# EAGLE design Qwiic_Spectral_Sensor-AS7265x-BottomJig (EAGLE 9.2.1)
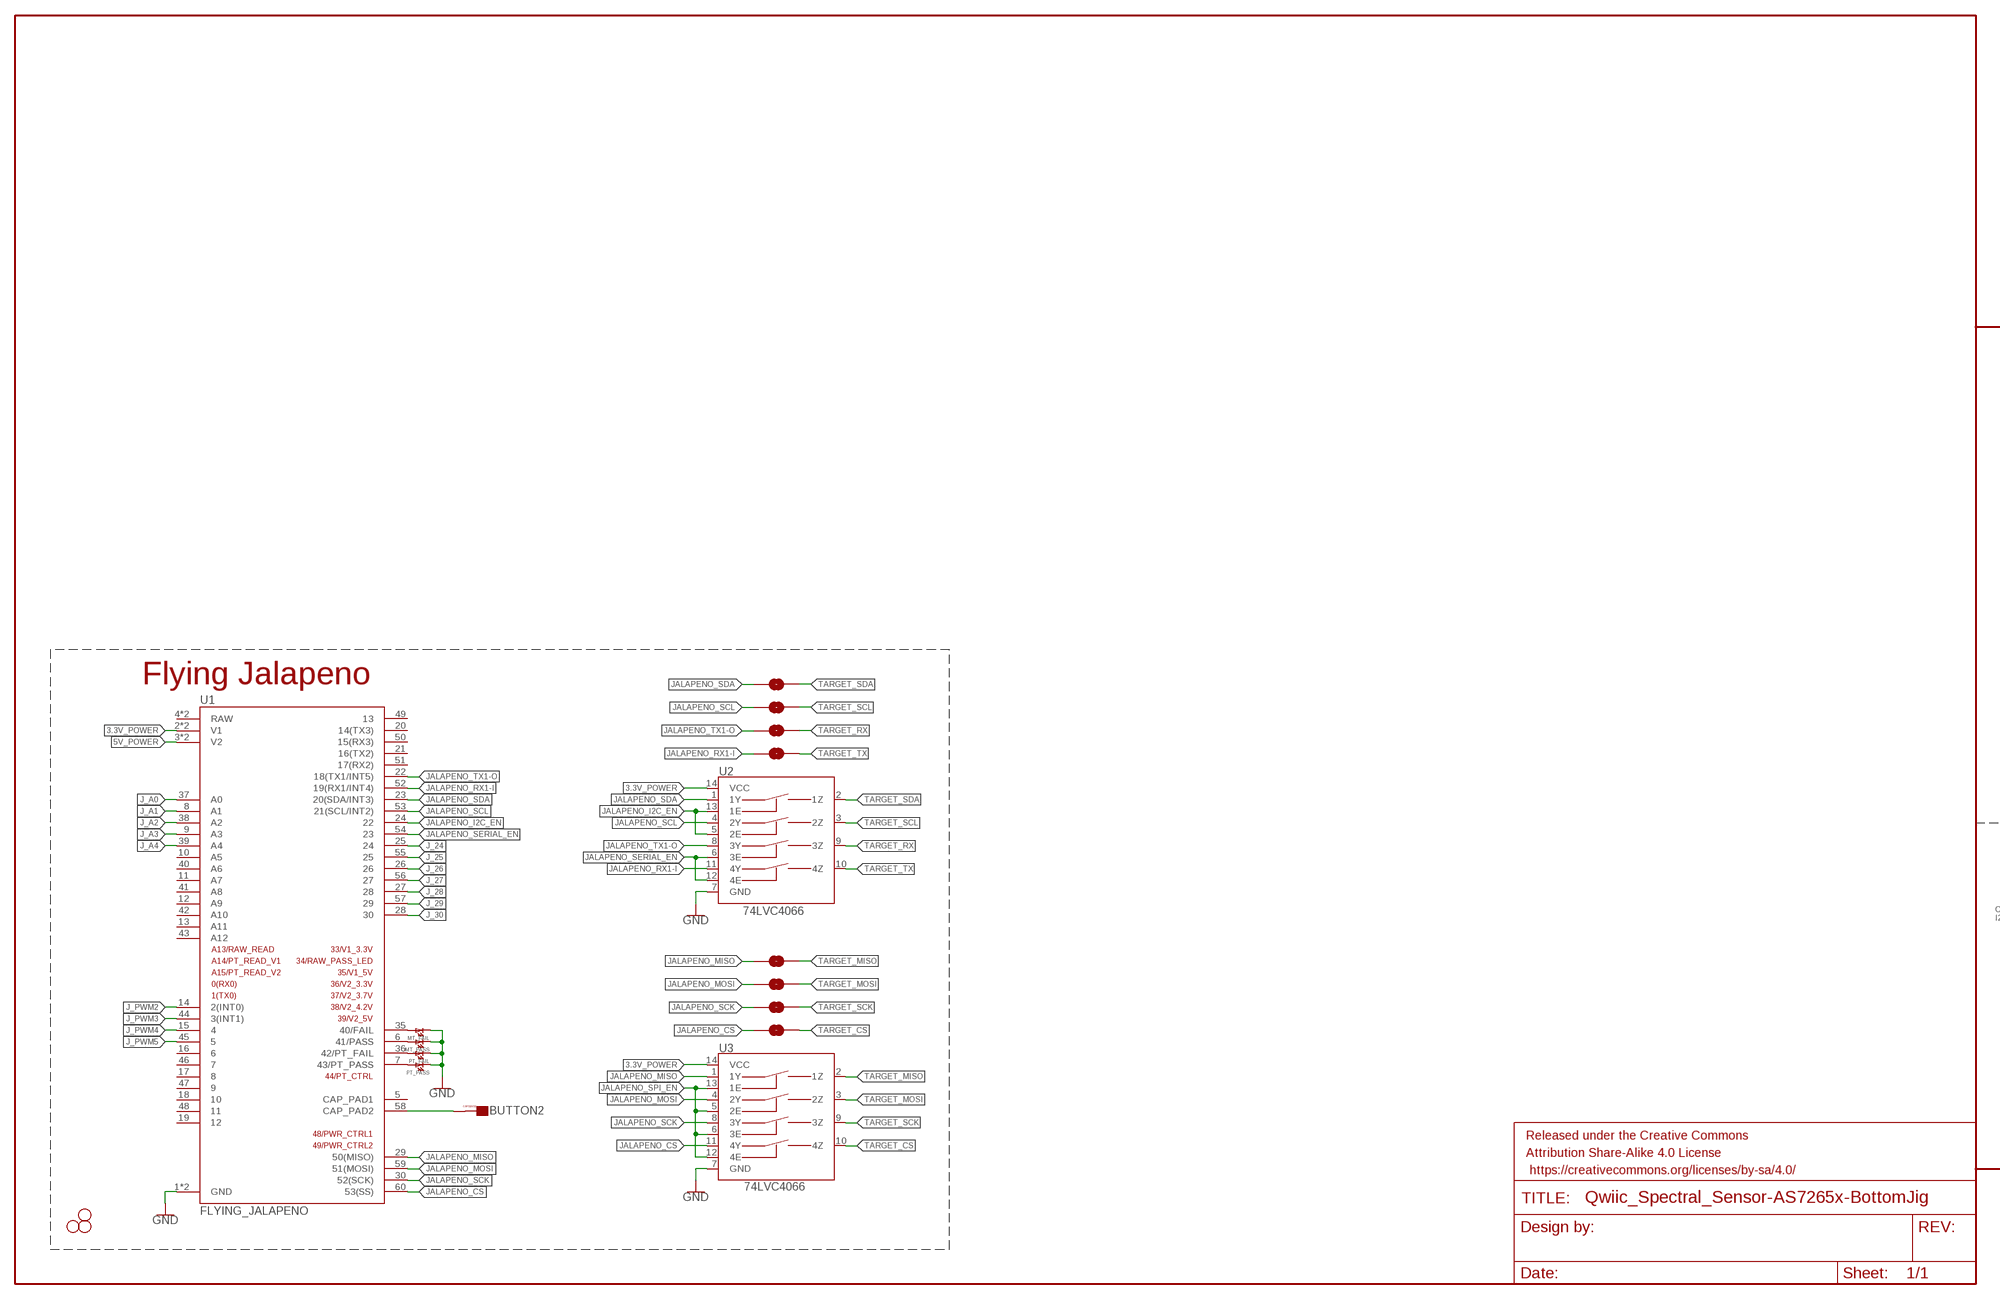
[diagram p0: schematic, sheet 1, part 1 of 2]
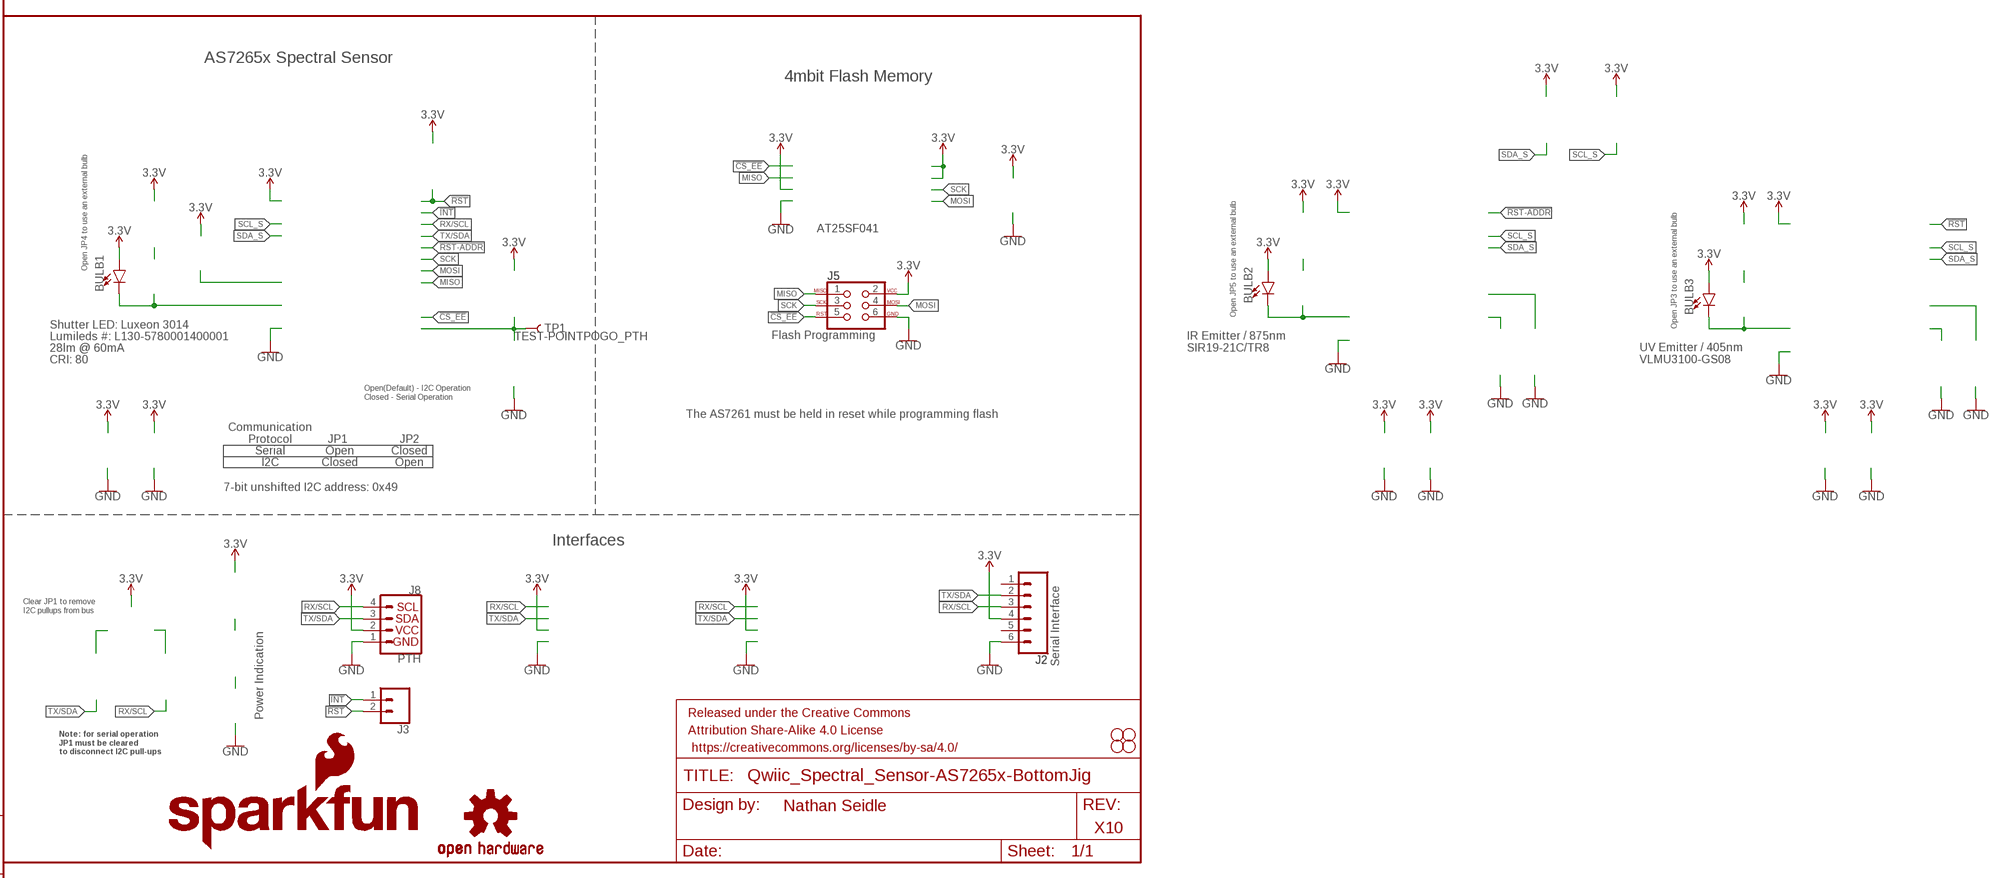
[diagram p1: schematic, sheet 1, part 2 of 2]

## Parts
BULB1  LEDNS  [LED_5MM_NOSILK]
BULB2  LEDNS  [LED_5MM_NOSILK]
BULB3  LEDNS  [LED_5MM_NOSILK]
BUTTON2  CAPSENSE_BUTTON_PAD_ONLY  [CAPSENSE_BUTTON_PADS_ONLY]
FRAME1  FRAME-LETTER  [CREATIVE_COMMONS]
FRAME2  FRAME-LEDGER  [CREATIVE_COMMONS]
H1  STAND-OFF  [STAND-OFF]
H2  STAND-OFF  [STAND-OFF]
H3  STAND-OFF  [STAND-OFF]
H4  STAND-OFF  [STAND-OFF]
H5  STAND-OFF  [STAND-OFF]
H6  STAND-OFF  [STAND-OFF]
H7  STAND-OFF  [STAND-OFF]
J2  Serial Interface  CONN_06NO_SILK_FEMALE_PTH  [1X06_NO_SILK]
J3  CONN_021X02_NO_SILK  [1X02_NO_SILK]
J5  Flash Programming  AVR_SPI_PROG_3X2NS  [2X3-NS]
J8  PTH  I2C_STANDARD_NO_SILK  [1X04_NO_SILK]
J_SCL  JUMPER-SMT_2_NO_NO-SILK  [SMT-JUMPER_2_NO_NO-SILK]
J_SCL1  JUMPER-SMT_2_NO_NO-SILK  [SMT-JUMPER_2_NO_NO-SILK]
J_SCL2  JUMPER-SMT_2_NO_NO-SILK  [SMT-JUMPER_2_NO_NO-SILK]
J_SCL3  JUMPER-SMT_2_NO_NO-SILK  [SMT-JUMPER_2_NO_NO-SILK]
J_SCL4  JUMPER-SMT_2_NO_NO-SILK  [SMT-JUMPER_2_NO_NO-SILK]
J_SCL5  JUMPER-SMT_2_NO_NO-SILK  [SMT-JUMPER_2_NO_NO-SILK]
J_SDA  JUMPER-SMT_2_NO_NO-SILK  [SMT-JUMPER_2_NO_NO-SILK]
J_SDA1  JUMPER-SMT_2_NO_NO-SILK  [SMT-JUMPER_2_NO_NO-SILK]
LOGO1  SFE_LOGO_NAME_FLAME.1_INCH  [SFE_LOGO_NAME_FLAME_.1]
LOGO4  OSHW-LOGOS  [OSHW-LOGO-S]
MT_FAIL  LED1206  [LED-1206]
MT_PASS  LED1206  [LED-1206]
PT_FAIL  LED1206  [LED-1206]
PT_PASS  LED1206  [LED-1206]
TP1  TEST-POINTPOGO_PTH  [1X01_NO_SILK]
U1  FLYING_JALAPENO  FLYING_JALAPENO_V3MALE  [FLYING_JALAPENO_V3_M]
U2  74LVC4066  74LVC4066_MUX_1:1_X4  [SO14]
U3  74LVC4066  74LVC4066_MUX_1:1_X4  [SO14]

## Nets
3.3V [VCC]: BULB1.A BULB2.A BULB3.A J2.4 J5.2 J8.2
3.3V_POWER [VCC]: U1.2(V1) U1.32(V1) U2.14(VCC) U3.14(VCC)
5V_POWER [POWA]: U1.3(V2) U1.33(V2)
!CS_EE: J5.5
!INT: J3.1
!RST: J3.2
BUTTON2 [CAPSENSE]: BUTTON2.CAPSENSE_PAD(CAPSENSE) U1.58(CAP_PAD2)
GND: J2.6 J5.6 J8.1 MT_FAIL.C MT_PASS.C PT_FAIL.C PT_PASS.C U1.1(GND) U1.31(GND) U2.7(GND) U3.7(GND)
I2C_ENB: TP1.1
J_24: U1.25
J_25: U1.55
J_26: U1.26
J_27: U1.56
J_28: U1.27
J_29: U1.57
J_30: U1.28
J_A0: U1.37(A0)
J_A1: U1.8(A1)
J_A2: U1.38(A2)
J_A3: U1.9(A3)
J_A4: U1.39(A4)
J_PWM2: U1.14(2(INT0))
J_PWM3: U1.44(3(INT1))
J_PWM4: U1.15
J_PWM5: U1.45
JALAPENO_CS: J_SDA1.1 U1.60(53(SS)) U3.11(4Y)
JALAPENO_I2C_EN: U1.24 U2.5(2E) U2.13(1E)
JALAPENO_MISO: J_SCL5.1 U1.29(50(MISO)) U3.1(1Y)
JALAPENO_MOSI: J_SCL3.1 U1.59(51(MOSI)) U3.4(2Y)
JALAPENO_RX1-I: J_SDA.1 U1.52(19(RX1/INT4)) U2.11(4Y)
JALAPENO_SCK: J_SCL4.1 U1.30(52(SCK)) U3.8(3Y)
JALAPENO_SCL: J_SCL.1 U1.53(21(SCL/INT2)) U2.4(2Y)
JALAPENO_SDA: J_SCL2.1 U1.23(20(SDA/INT3)) U2.1(1Y)
JALAPENO_SERIAL_EN: U1.54 U2.6(3E) U2.12(4E)
JALAPENO_SPI_EN: U3.5(2E) U3.6(3E) U3.12(4E) U3.13(1E)
JALAPENO_TX1-O: J_SCL1.1 U1.22(18(TX1/INT5)) U2.8(3Y)
LED_DRV: BULB1.K(C)
LED_DRV1: BULB2.K(C)
LED_DRV2: BULB3.K(C)
MISO: J5.1
MOSI: J5.4
N$10: PT_PASS.A U1.7(43/PT_PASS)
N$14: PT_FAIL.A U1.36(42/PT_FAIL)
N$15: MT_PASS.A U1.6(41/PASS)
N$16: MT_FAIL.A U1.35(40/FAIL)
RX/SCL: J2.3 J8.4
SCK: J5.3
TARGET_CS: J_SDA1.2 U3.10(4Z)
TARGET_MISO: J_SCL5.2 U3.2(1Z)
TARGET_MOSI: J_SCL3.2 U3.3(2Z)
TARGET_RX: J_SCL1.2 U2.9(3Z)
TARGET_SCK: J_SCL4.2 U3.9(3Z)
TARGET_SCL: J_SCL.2 U2.3(2Z)
TARGET_SDA: J_SCL2.2 U2.2(1Z)
TARGET_TX: J_SDA.2 U2.10(4Z)
TX/SDA: J2.2 J8.3
Unconnected: J2.1 J2.5 U1.4(RAW) U1.5(CAP_PAD1) U1.10(A5) U1.11(A7) U1.12(A9) U1.13(A11) U1.16 U1.17 U1.18 U1.19 U1.20(14(TX3)) U1.21(16(TX2)) U1.34(RAW) U1.40(A6) U1.41(A8) U1.42(A10) U1.43(A12) U1.46 U1.47 U1.48 U1.49 U1.50(15(RX3)) U1.51(17(RX2))

## Notes on the sheet
- AS7265x Spectral Sensor
- 4mbit Flash Memory
- AT25SF041
- Open JP4 to use an external bulb
- Open JP5 to use an external bulb
- Shutter LED: Luxeon 3014 | Open JP3 to use an external bulb
- Lumileds #: L130-5780001400001
- 28lm @ 60mA
- IR Emitter / 875nm
  SIR19-21C/TR8
- CRI: 80
- UV Emitter / 405nm
  VLMU3100-GS08
- Flying Jalapeno
- Open(Default) - I2C Operation
  Closed - Serial Operation
- The AS7261 must be held in reset while programming flash
- Communication
  Protocol
- JP1 | JP2
- Serial | Open | Closed
- I2C | Closed | Open
- 7-bit unshifted I2C address: 0x49
- Interfaces
- Clear JP1 to remove
  I2C pullups from bus
- Power Indication
- Note: for serial operation
  JP1 must be cleared
  to disconnect I2C pull-ups
- Nathan Seidle
- X10

## Library data of the parts
BULB1-BULB3 = SparkX:LED
BUTTON2 = Testing:CAPSENSE_BUTTON_PAD_ONLY
FRAME1 = SparkFun-Aesthetics:FRAME-LETTER: Schematic Frame - Letter Standard 8.5x11 US Letter frame
FRAME2 = SparkFun-Aesthetics:FRAME-LEDGER: Schematic Frame - Ledger Standard 11x14 US Ledger frame
H1-H7 = SparkFun-Hardware:STAND-OFF: Stand Off Drill holes for mechanically mounting via screws, standoffs, etc. Note: Use the keepout ring to avoid running the screw head into surrounding components. Variant Overviews STAND-OFF - Mechanical footprint for a #4 phillips button head screw. STAND-OFF-TIGHT - Mechanical footprint for a #4 phillips button head screw, Example SparkFun Products Screw - Phillips Head (1/4", 4-40, 10 pack) <https://www.sparkfun.com/products/10453> (PRT-10453) Screw - Phillips Head (1/2", 4-40, 10 pack) <https://www.sparkfun.com/products/10452> (PRT-10452) Screw - Phillips Head (3/4", 4-40, 10 pack) <https://www.sparkfun.com/products/10451> (PRT-10451) Screw - Phillips Head (1", 4-40, 10 pack) <https://www.sparkfun.com/products/10450> (PRT-10450)
J2 = SparkFun-Connectors:CONN_06: Multi connection point. Often used as Generic Header-pin footprint for 0.1 inch spaced/style header connections On any of the 0.1 inch spaced packages, you can populate with these: Break Away Headers - Straight <https://www.sparkfun.com/products/116> (PRT-00116) Break Away Male Headers - Right Angle <https://www.sparkfun.com/products/553> (PRT-00553) Female Headers <https://www.sparkfun.com/products/115> (PRT-00115) Break Away Headers - Machine Pin <https://www.sparkfun.com/products/117> (PRT-00117) Break Away Female Headers - Swiss Machine Pin <https://www.sparkfun.com/products/743> (PRT-00743) Arduino Stackable Header - 6 Pin <https://www.sparkfun.com/products/9280> (PRT-09280) For SCREWTERMINALS and SPRING TERMINALS visit here: Screw Terimnals on SparkFun.com <https://www.sparkfun.com/search/results?term=Screw+Terminals> (5mm/3.5mm/2.54mm spacing) This device is also useful as a general connection point to wire up your design to another part of your project. Our various solder wires solder well into these plated through hole pads. Hook-Up Wire - Assortment (Stranded, 22 AWG) <https://www.sparkfun.com/products/11375> (PRT-11375) Hook-Up Wire - Assortment (Solid Core, 22 AWG) <https://www.sparkfun.com/products/11367> (PRT-11367) View the entire wire category on our website here <https://www.sparkfun.com/categories/141>; PROD_ID: CONN-08437
J3 = SparkFun-Connectors:CONN_02: Multi connection point. Often used as Generic Header-pin footprint for 0.1 inch spaced/style header connections On any of the 0.1 inch spaced packages, you can populate with these: Break Away Headers - Straight <https://www.sparkfun.com/products/116> (PRT-00116) Break Away Male Headers - Right Angle <https://www.sparkfun.com/products/553> (PRT-00553) Female Headers <https://www.sparkfun.com/products/115> (PRT-00115) Break Away Headers - Machine Pin <https://www.sparkfun.com/products/117> (PRT-00117) Break Away Female Headers - Swiss Machine Pin <https://www.sparkfun.com/products/743> (PRT-00743) For SCREWTERMINALS and SPRING TERMINALS visit here: Screw Terimnals on SparkFun.com <https://www.sparkfun.com/search/results?term=Screw+Terminals> (5mm/3.5mm/2.54mm spacing) This device is also useful as a general connection point to wire up your design to another part of your project. Our various solder wires solder well into these plated through hole pads. Hook-Up Wire - Assortment (Stranded, 22 AWG) <https://www.sparkfun.com/products/11375> (PRT-11375) Hook-Up Wire - Assortment (Solid Core, 22 AWG) <https://www.sparkfun.com/products/11367> (PRT-11367) View the entire wire category on our website here <https://www.sparkfun.com/categories/141> Special notes: Molex polarized connector foot print use with: PRT-08233 with associated crimp pins and housings. 2.54_SCREWTERM for use with PRT-10571. 3.5mm Screw Terminal footprints for PRT-08084 5mm Screw Terminal footprints for use with PRT-08432
J5 = SparkFun-Connectors:AVR_SPI_PROG_3X2: AVR ISP 6 Pin This is the reduced ISP connector for AVR programming. Common on Arduino. This footprint will take up less PCB space and can be used with a 10-pin to 6-pin adapter such as SKU: BOB-08508 **Special note about "TEST_POINT" package. The stop mask is on the top side, so if you want your programming test points to be on the bottom of your board, make sure to place this package on the bottom side of the board. This also ensure that the orientation to program from the bottom side will be correct. SparkFun Products: SparkFun ISP Pogo Adapter <https://www.sparkfun.com/products/11591> - NS Tiny AVR Programmer <https://www.sparkfun.com/products/11801> -PTH
J8 = SparkFun-Connectors:I2C_STANDARD: SparkFun I2C Standard Pinout Header SparkFun has standardized on a pinout for all I2C based sensor breakouts. This pinout allows I2C boards to be plugged directly into the headers on Arduino Uno compatible boards, and to be daisy chained easily. Example SparkFun Products: SparkFun Atmospheric Sensor Breakout - BME280 <https://www.sparkfun.com/products/13676> SparkFun Altitude/Pressure Sensor Breakout - MPL3115A2 <https://www.sparkfun.com/products/11084> SparkFun TOF Range Finder Sensor - VL6180 <https://www.sparkfun.com/products/12785>
J_SCL J_SCL1-J_SCL5 J_SDA J_SDA1 = SparkFun-Jumpers:JUMPER-SMT_2_NO: Normally open jumper This jumper has two pads in close proximity to each other. Apply solder to close the connection. Round pads are easier to solder for beginners, but are a lot larger. SparkFun Product that uses the round pads: SparkFun EL Sequencer <https://www.sparkfun.com/products/12781>
LOGO1 = SparkFun-Aesthetics:SFE_LOGO_NAME_FLAME: SparkFun Font Logo w/ Flame This is the SparkFun full logo. The logo on the schematic will always be the same size; the package variant is the height of the flame part of the logo. Default layer for the logo on the board is tSilk.
LOGO4 = SparkFun-Aesthetics:OSHW-LOGO: Open-Source Hardware (OSHW) Logo This logo indicates the piece of hardware it is found on incorporates a OSHW license and/or adheres to the definition of open source hardware found here: http://freedomdefined.org/OSHW
MT_FAIL MT_PASS PT_FAIL PT_PASS = Testing:LED: LEDs Standard schematic elements and footprints for 5mm, 3mm, 1206, and 0603 sized LEDs. 5mm - Spark Fun Electronics SKU : COM-00529 (and others)
TP1 = SparkFun-Connectors:TEST-POINT: SparkFun Test Points Bare copper test points for troubleshooting or In-Circuit-Testing. These are used by our Production team for verifying production board runs using pogo-pins on test beds. SparkFun Products: SparkFun LSM9DS1 Breakout <https://www.sparkfun.com/products/13284> SparkFun PSOC <https://www.sparkfun.com/products/13714> SparkFun Load Cell Amplifier <https://www.sparkfun.com/products/13879>
U1 = Testing:FLYING_JALAPENO_V3
U2 U3 = Testing:74LVC4066_MUX_1:1_X4

## Net classes
1 VCC: width 0.381 mm
2 POWA: width 0.61 mm
3 CAPSENSE: width 0.508 mm

## Board
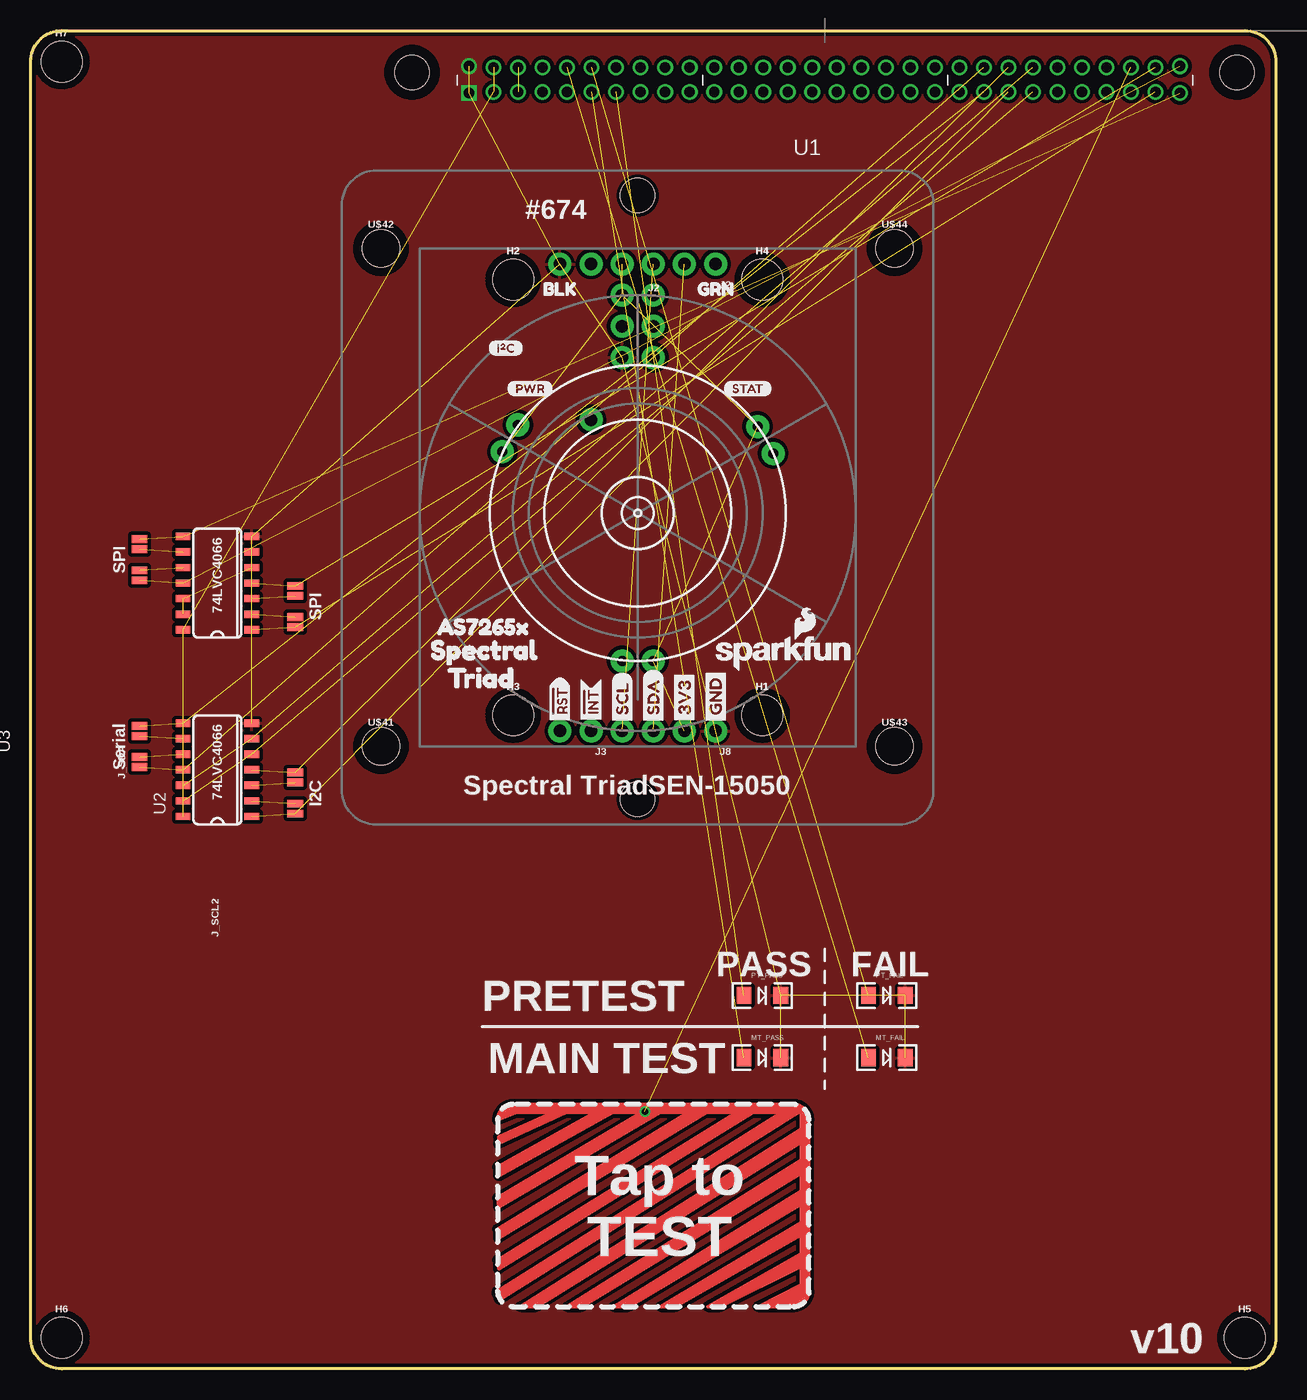
[diagram p2: board, top side]
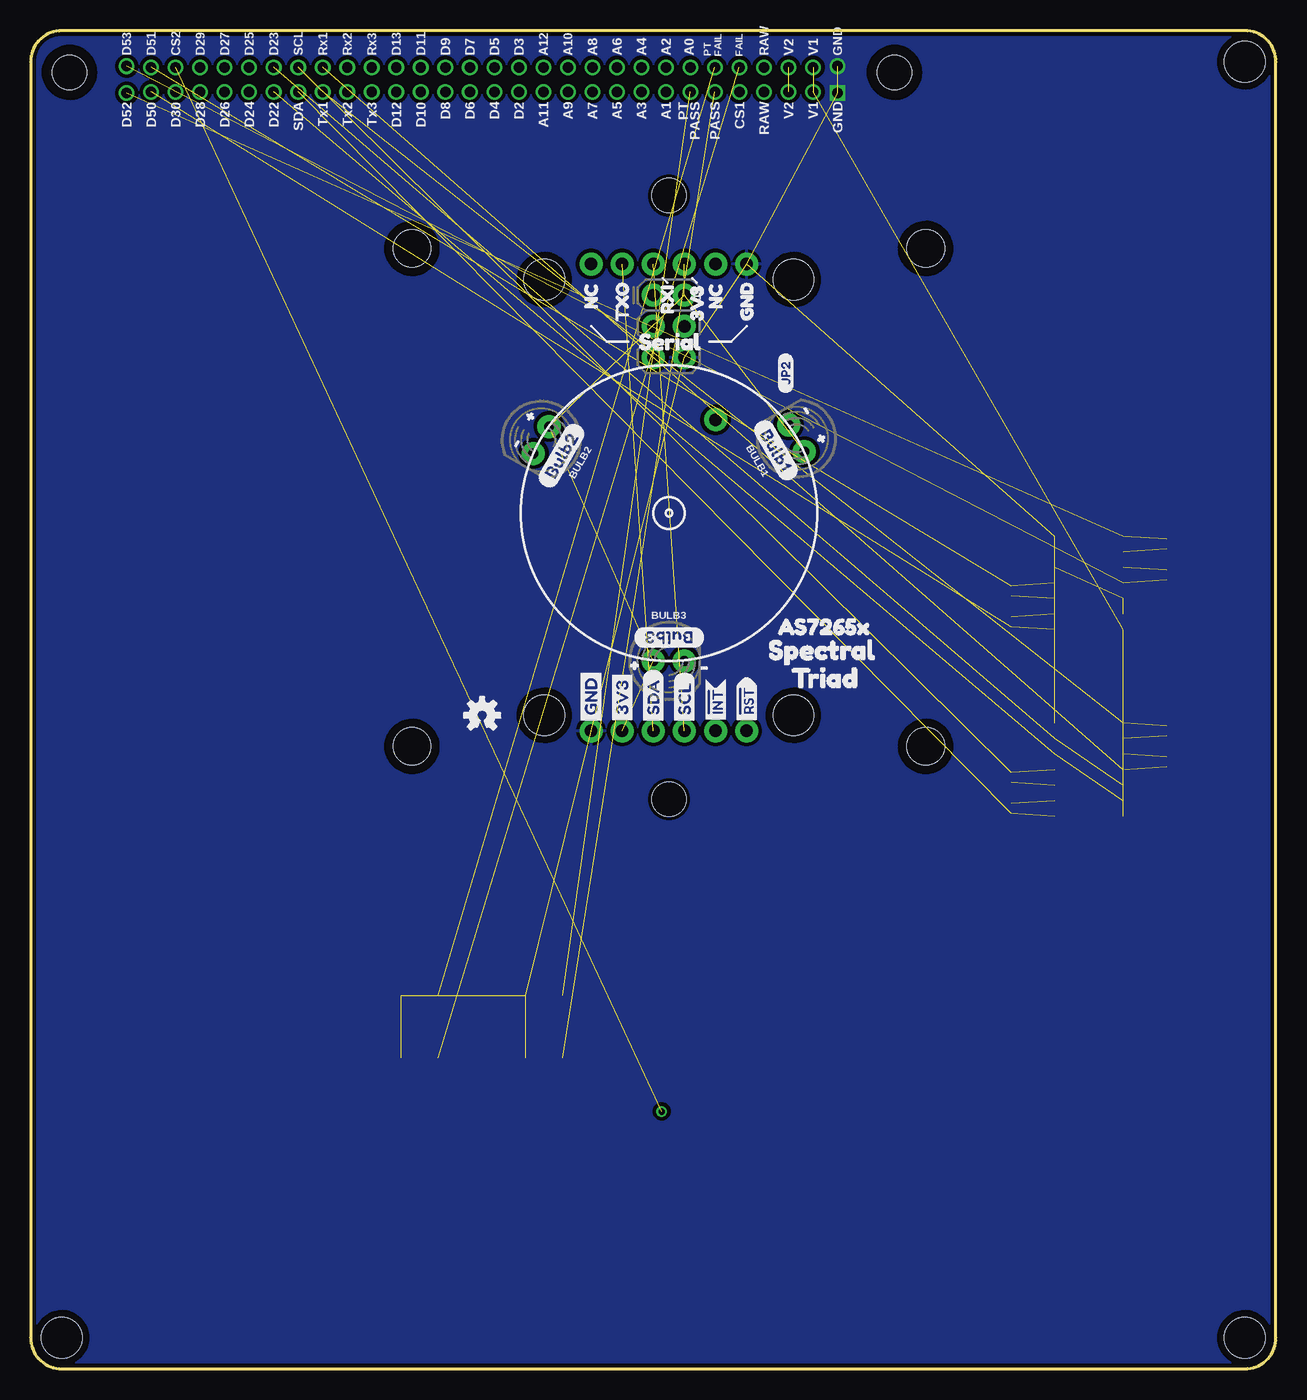
[diagram p3: board, bottom side, seen from below]

Size 101.6 x 109.22 mm. Coordinates in mm from the lower left corner, seen from the top.
Outline: 2.54,109.22 99.06,109.22 arc-90 101.6,106.68 101.6,2.54 arc-90 99.06,0 2.54,0 arc-90 0,2.54 0,106.68 arc-90 2.54,109.22
Copper layers (1*16): Top 0.035mm / dielectric 1.5mm / Bottom 0.035mm
Design rules "SparkFun-2-layer-TIGHT": minimum track width 7mil, minimum drill 15mil, track to track 7mil, track to pad 7mil, pad to pad 7mil, via to via 7mil, smd to smd 7mil, copper to edge 7mil, drill to drill 7mil, minimum pad ring 7mil, minimum via ring 7mil, stop-mask expansion 4mil, vias tented up to drill 25mil, thermal gap 10mil

### Footprints (pad centres in the part's own frame; a part is rotated, then mirrored left to right if it is on the bottom)
LED_5MM_NOSILK = drill 0.813 pad 1.88: A -1.27,0; K 1.27,0
CAPSENSE_BUTTON_PADS_ONLY = drill 0.508: CAPSENSE_PAD -0.686,7.036
STAND-OFF = hole 3.302: 0,0
1X06_NO_SILK = drill 1.016 pad 1.88: 1 0,0; 2 2.54,0; 3 5.08,0; 4 7.62,0; 5 10.16,0; 6 12.7,0
1X02_NO_SILK = drill 1.016 pad 1.88: 1 0,0; 2 2.54,0
2X3-NS = drill 1.016 pad 1.88: 1 -2.54,-1.27; 2 -2.54,1.27; 3 0,-1.27; 4 0,1.27; 5 2.54,-1.27; 6 2.54,1.27
1X04_NO_SILK = drill 1.016 pad 1.88: 1 0,0; 2 2.54,0; 3 5.08,0; 4 7.62,0
SMT-JUMPER_2_NO_NO-SILK = smd 0.635 x 1.27: 1 -0.406,0; 2 0.406,0
LED-1206 = smd 1.2 x 1.4: A -1.5,0; C 1.5,0
1X01_NO_SILK = drill 1.016 pad 1.88: 1 0,0
FLYING_JALAPENO_V3_M = drill 0.85 square: 1 -29,-5.1 | drill 0.85: 2 -27,-5; 3 -25,-5; 4 -23,-5; 5 -21,-5; 6 -19,-5; 7 -17,-5; 8 -15,-5; 9 -13,-5; 10 -11,-5; 11 -9,-5; 12 -7,-5; 13 -5,-5; 14 -3,-5; 15 -1,-5; 16 1,-5; 17 3,-5; 18 5,-5; 19 7,-5; 20 9,-5; 21 11,-5; 22 13,-5; 23 15,-5; 24 17,-5; 25 19,-5; 26 21,-5; 27 23,-5; 28 25,-5; 29 27,-5; 30 29,-5.1; 31 -29,-2.9; 32 -27,-3; 33 -25,-3; 34 -23,-3; 35 -21,-3; 36 -19,-3; 37 -17,-3; 38 -15,-3; 39 -13,-3; 40 -11,-3; 41 -9,-3; 42 -7,-3; 43 -5,-3; 44 -3,-3; 45 -1,-3; 46 1,-3; 47 3,-3; 48 5,-3; 49 7,-3; 50 9,-3; 51 11,-3; 52 13,-3; 53 15,-3; 54 17,-3; 55 19,-3; 56 21,-3; 57 23,-3; 58 25,-3; 59 27,-3; 60 29,-2.9 | hole 2.794: 33.655,-3.404; -33.655,-3.404
SO14 = smd 0.6 x 1.2: 1 -3.175,-2.8; 2 -1.905,-2.8; 3 -0.635,-2.8; 4 0.635,-2.8; 5 1.905,-2.8; 6 3.175,-2.8; 7 4.445,-2.8; 8 4.445,2.8; 9 3.175,2.8; 10 1.905,2.8; 11 0.635,2.8; 12 -0.635,2.8; 13 -1.905,2.8; 14 -3.175,2.8
STAND-OFF-TIGHT = hole 3.048: 0,0
NUBBIN_LOCKER = hole 2.794: 0,0

### Placement (x,y rotation side)
BULB1  39.12,75.95 120 bottom
BULB2  59.94,75.82 240 bottom
BULB3  49.53,57.79 0 bottom
BUTTON2  50.8,13.97 0 top
FRAME1  -25.4,-30.48 0 top  (outside the outline)
FRAME2  -25.4,-39.37 0 top  (outside the outline)
H1  59.69,53.34 0 top
H2  39.37,88.9 0 top
H3  39.37,53.34 0 top
H4  59.69,88.9 0 top
H5  99.06,2.54 0 top
H6  2.54,2.54 0 top
H7  2.54,106.68 0 top
J2  55.88,90.17 180 top
J3  45.72,52.07 180 top
J5  49.53,85.09 270 bottom
J8  55.88,52.07 180 top
J_SCL  21.59,48.26 270 top
J_SCL1  8.89,52.07 270 top
J_SCL2  21.59,45.72 90 top
J_SCL3  21.59,63.5 270 top
J_SCL4  8.89,67.31 270 top
J_SCL5  21.59,60.96 90 top
J_SDA  8.89,49.53 90 top
J_SDA1  8.89,64.77 90 top
LOGO1  61.47,58.42 0 top
LOGO4  64.77,53.34 0 bottom
MT_FAIL  69.85,25.4 0 top
MT_PASS  59.69,25.4 0 top
PT_FAIL  69.85,30.48 0 top
PT_PASS  59.69,30.48 0 top
TP1  45.72,77.47 0 bottom
U1  64.77,109.22 0 top
U2  15.24,48.26 90 top
U3  15.24,63.5 90 top
U$1  [#0]  61.59,76.71 60 bottom
U$2  [I_SUPER2_C-()-03]  37.34,83.31 0 top
U$3  [PWR-()-03]  38.86,80.01 0 top
U$4  [AS7265X0]  32,60.58 0 top
U$5  [BULB15]  42.16,77.34 300 bottom
U$6  [BULB26]  59.82,71.88 60 bottom
U$7  [BULB37]  46.61,59.69 180 bottom
U$8  [JP20]  40.01,79.63 90 bottom
U$9  [SPECTRAL1]  31.24,58.67 0 top
U$10  [STAT4]  56.52,80.01 0 top
U$11  [TRIAD2]  32.64,56.39 0 top
U$12  [TRIAD2]  40.89,56.39 0 bottom
U$13  [SPECTRAL1]  42.8,58.67 0 bottom
U$14  [AS7265X0]  41.78,60.58 0 bottom
U$15  [3V33]  47.24,84.45 90 bottom
U$16  [BLK7]  40.89,88.14 0 top
U$17  [GND5]  43.18,84.71 90 bottom
U$18  [GRN6]  53.34,88.14 0 top
U$19  [NC4]  55.88,85.6 90 bottom
U$20  [NC4]  45.72,85.6 90 bottom
U$21  [RXI2]  49.66,85.22 90 bottom
U$22  [SERIAL0]  53.09,83.82 0 bottom
U$23  [TXO1]  53.34,84.58 90 bottom
U$24  [3V3-04]  53.34,52.45 90 bottom
U$25  [GND-04]  55.88,52.45 90 bottom
U$26  [SDA-[)]  50.8,52.45 90 bottom
U$27  [SCL-[)]  48.26,52.45 90 bottom
U$28  [INT#-[<-04]  45.72,52.32 90 bottom
U$29  [RST#-[>-04]  43.18,52.32 90 bottom
U$30  [GND-04]  55.88,52.45 90 top
U$31  [3V3-04]  53.34,52.45 90 top
U$32  [SDA-[)]  50.8,52.45 90 top
U$33  [SCL-[)]  48.26,52.45 90 top
U$34  [INT#-[<-04]  45.72,52.32 90 top
U$35  [RST#-[>-04]  43.18,52.32 90 top
U$36  [#0]  37.59,77.09 300 bottom
U$37  [#0]  53.59,57.53 0 bottom
U$38  [#1]  47.88,57.4 0 bottom
U$39  [#1]  38.73,79.38 300 bottom
U$40  [#1]  62.74,74.55 60 bottom
U$41  [STAND-OFF-TIGHT]  28.58,50.8 0 top
U$42  [STAND-OFF-TIGHT]  28.58,91.44 0 top
U$43  [STAND-OFF-TIGHT]  70.48,50.8 0 top
U$44  [STAND-OFF-TIGHT]  70.48,91.44 0 top
U$45  [NUBBIN_LOCKER]  49.53,46.48 0 top
U$46  [NUBBIN_LOCKER]  49.53,95.76 0 top

### Tracks (layer width: path | path; a pad name or v marks a point on that pad's centre or on a via)
3.3V  (5 unrouted)
3.3V_POWER  (3 unrouted)
5V_POWER  (1 unrouted)
BUTTON2  (1 unrouted)
GND  (10 unrouted)
  pour Top (isolate 0.305): 0,109.22 101.6,109.22 101.6,0 0,0
  pour Bottom (isolate 0.305): 0,109.22 101.6,109.22 101.6,0 0,0
JALAPENO_CS  (2 unrouted)
JALAPENO_I2C_EN  (2 unrouted)
JALAPENO_MISO  (2 unrouted)
JALAPENO_MOSI  (2 unrouted)
JALAPENO_RX1-I  (2 unrouted)
JALAPENO_SCK  (2 unrouted)
JALAPENO_SCL  (2 unrouted)
JALAPENO_SDA  (2 unrouted)
JALAPENO_SERIAL_EN  (2 unrouted)
JALAPENO_SPI_EN  (3 unrouted)
JALAPENO_TX1-O  (2 unrouted)
N$10  (1 unrouted)
N$14  (1 unrouted)
N$15  (1 unrouted)
N$16  (1 unrouted)
RX/SCL  (1 unrouted)
TARGET_CS  (1 unrouted)
TARGET_MISO  (1 unrouted)
TARGET_MOSI  (1 unrouted)
TARGET_RX  (1 unrouted)
TARGET_SCK  (1 unrouted)
TARGET_SCL  (1 unrouted)
TARGET_SDA  (1 unrouted)
TARGET_TX  (1 unrouted)
TX/SDA  (1 unrouted)

### Text on the board
tPlace: #674 | SPI | SPI | Serial | Spectral Triad | SEN-15050 | I2C | PASS | FAIL | PRETEST | MAIN TEST | Tap to / TEST | v10
bPlace: GND
tDocu: Nathan Seidle